# EasyEDA schematic Schaltplan_Vier-Gewinnt_V3.json
TITLE: Schaltplan Vier-Gewinnt; REV: 3.0; Date: 2023-09-05; Sheet: 1/1; Drawn By: lucaskri; Company: WAGO
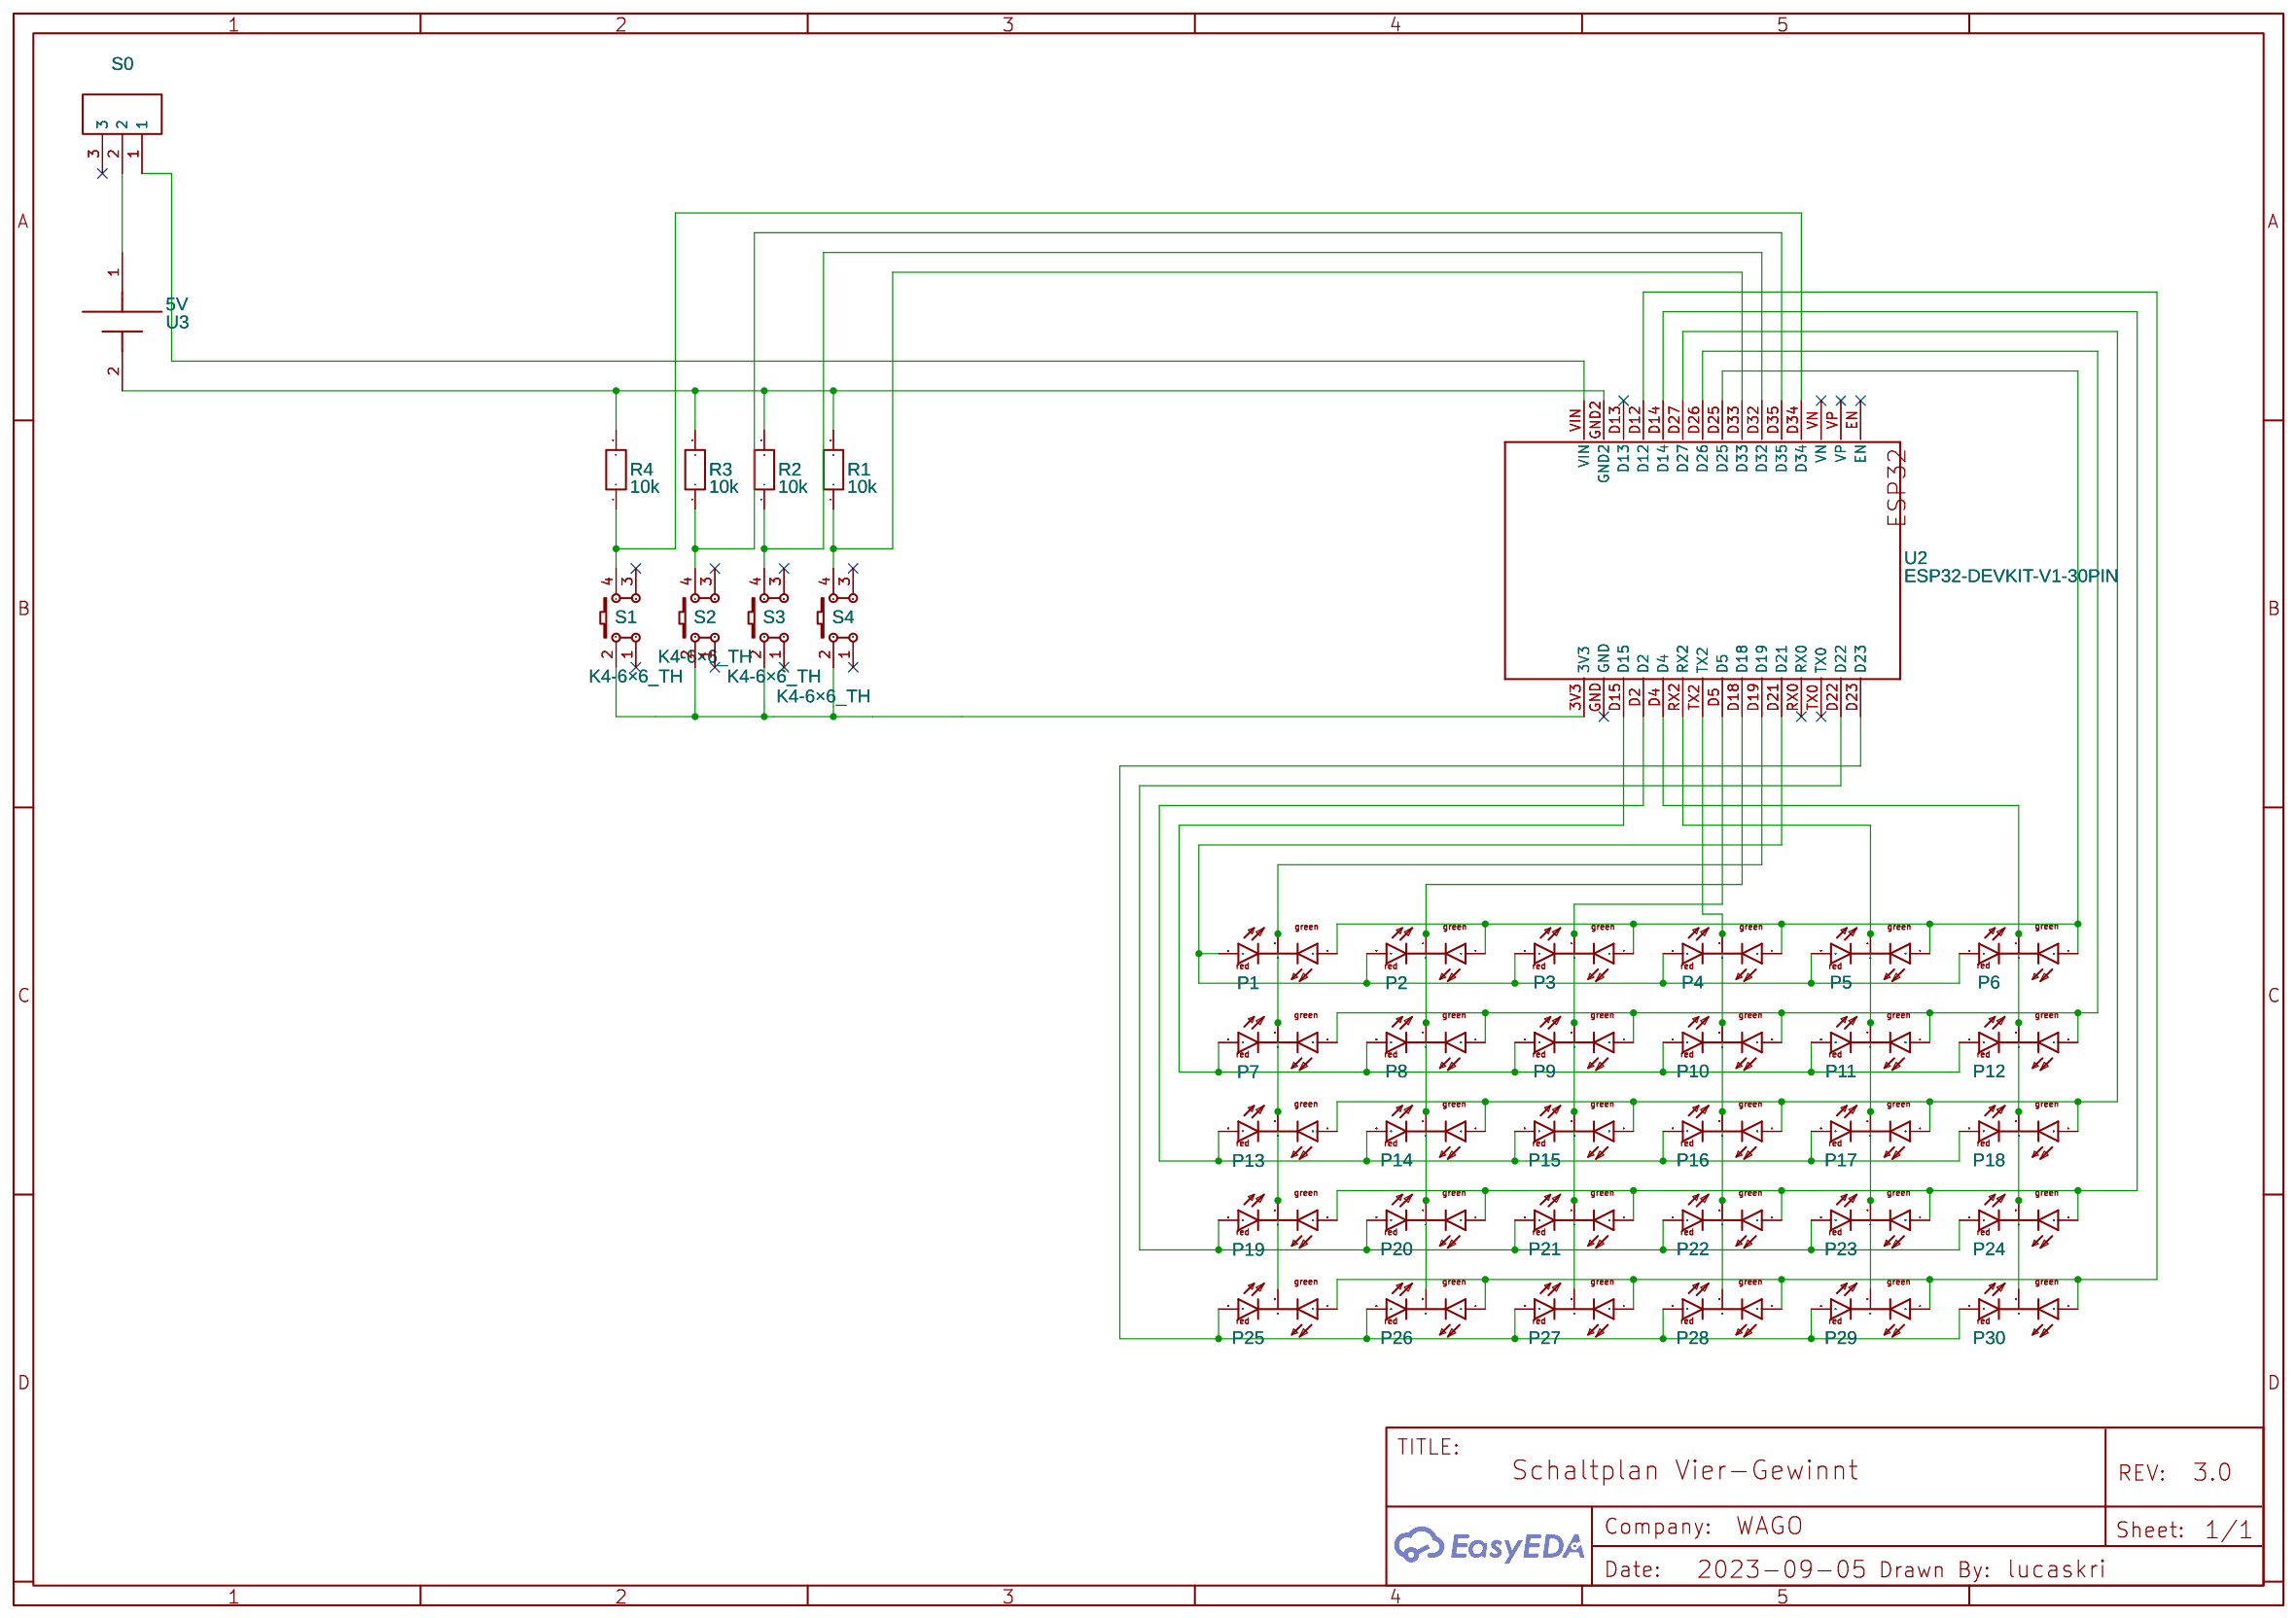
[diagram p0: schematic sheet]

## Parts
P1  NO  [DUOLED-C-5MM]
P2  NO  [DUOLED-C-5MM]
P3  NO  [DUOLED-C-5MM]
P4  NO  [DUOLED-C-5MM]
P5  NO  [DUOLED-C-5MM]
P6  NO  [DUOLED-C-5MM]
P7  NO  [DUOLED-C-5MM]
P8  NO  [DUOLED-C-5MM]
P9  NO  [DUOLED-C-5MM]
P10  NO  [DUOLED-C-5MM]
P11  NO  [DUOLED-C-5MM]
P12  NO  [DUOLED-C-5MM]
P13  NO  [DUOLED-C-5MM]
P14  NO  [DUOLED-C-5MM]
P15  NO  [DUOLED-C-5MM]
P16  NO  [DUOLED-C-5MM]
P17  NO  [DUOLED-C-5MM]
P18  NO  [DUOLED-C-5MM]
P19  NO  [DUOLED-C-5MM]
P20  NO  [DUOLED-C-5MM]
P21  NO  [DUOLED-C-5MM]
P22  NO  [DUOLED-C-5MM]
P23  NO  [DUOLED-C-5MM]
P24  NO  [DUOLED-C-5MM]
P25  NO  [DUOLED-C-5MM]
P26  NO  [DUOLED-C-5MM]
P27  NO  [DUOLED-C-5MM]
P28  NO  [DUOLED-C-5MM]
P29  NO  [DUOLED-C-5MM]
P30  NO  [DUOLED-C-5MM]
R1  10k  [R_AXIAL-0.3]
R2  10k  [R_AXIAL-0.3]
R3  10k  [R_AXIAL-0.3]
R4  10k  [R_AXIAL-0.3]
S0  NO  [CSS-1201_FOOTPRINT]
S1  K4-6×6_TH  [KEY-TH_4P-L6.0-W6.0-P4.50-LS6.5]
S2  K4-6×6_TH  [KEY-TH_4P-L6.0-W6.0-P4.50-LS6.5]
S3  K4-6×6_TH  [KEY-TH_4P-L6.0-W6.0-P4.50-LS6.5]
S4  K4-6×6_TH  [KEY-TH_4P-L6.0-W6.0-P4.50-LS6.5]
U2  ESP32-DEVKIT-V1-30PIN  [ESP32-DEVKITV1_ESP32-DEVKITV1]
U3  5V  [BATTERIE]

## Library data of the parts
P1-P30 = DUOLED-RG-C: Contributor: dawodk
R1-R4 = R_AXIAL-0.3_EU: Contributor: LCEDA_Lib
S0 = CSS-1201: Supplier: ROBOMECHA; Contributor: mengkuk
S1-S4 = K4-6×6_TH: Supplier: LCSC; Supplier Part: C136684; Manufacturer: 韩国韩荣; Manufacturer Part: K2-1102DP-E4SW-04; Contributor: LCEDA_Lib
U2 = ESP32-DEVKIT-V1-30PIN: Contributor: u18040382
U3 = Batterie: Contributor: GMANF1

## Nets
Net-(P1-AR): P1.AR P2.AR P3.AR P4.AR P5.AR P6.AR U2.D21
Net-(P1-AX): P1.AX(AG) P2.AX(AG) P3.AX(AG) P4.AX(AG) P5.AX(AG) P6.AX(AG) U2.D25
Net-(P1-C): P1.C P7.C P13.C P19.C P25.C U2.D19
Net-(P2-C): P2.C P8.C P14.C P20.C P26.C U2.D18
Net-(P3-C): P3.C P9.C P15.C P21.C P27.C U2.D5
Net-(P4-C): P4.C P10.C P16.C P22.C P28.C U2.TX2
Net-(P5-C): P5.C P11.C P17.C P23.C P29.C U2.RX2
Net-(P6-C): P6.C P12.C P18.C P24.C P30.C U2.D4
Net-(P7-AR): P7.AR P8.AR P9.AR P10.AR P11.AR P12.AR U2.D15
Net-(P7-AX): P7.AX(AG) P8.AX(AG) P9.AX(AG) P10.AX(AG) P11.AX(AG) P12.AX(AG) U2.D26
Net-(P13-AR): P13.AR P14.AR P15.AR P16.AR P17.AR P18.AR U2.D2
Net-(P13-AX): P13.AX(AG) P14.AX(AG) P15.AX(AG) P16.AX(AG) P17.AX(AG) P18.AX(AG) U2.D27
Net-(P19-AR): P19.AR P20.AR P21.AR P22.AR P23.AR P24.AR U2.D22
Net-(P19-AX): P19.AX(AG) P20.AX(AG) P21.AX(AG) P22.AX(AG) P23.AX(AG) P24.AX(AG) U2.D14
Net-(P25-AR): P25.AR P26.AR P27.AR P28.AR P29.AR P30.AR U2.D23
Net-(P25-AX): P25.AX(AG) P26.AX(AG) P27.AX(AG) P28.AX(AG) P29.AX(AG) P30.AX(AG) U2.D12
Net-(R1-1): R1.1 S4.4 U2.D33
Net-(R1-2): R1.2 R2.2 R3.2 R4.2 U2.GND2 U3.2(-)
Net-(R2-1): R2.1 S3.4 U2.D32
Net-(R3-1): R3.1 S2.4 U2.D35
Net-(R4-1): R4.1 S1.4 U2.D34
Net-(S0-1): S0.1 U2.VIN
Net-(S0-2): S0.2 U3.1(+)
Net-(S1-2): S1.2 S2.2 S3.2 S4.2 U2.3V3

Not connected (* = marked no-connect by the designer): S0 3*; S1 1* 3*; S2 1* 3*; S3 1* 3*; S4 1* 3*; U2 D13* EN* GND* RX0* TX0* VN* VP*
